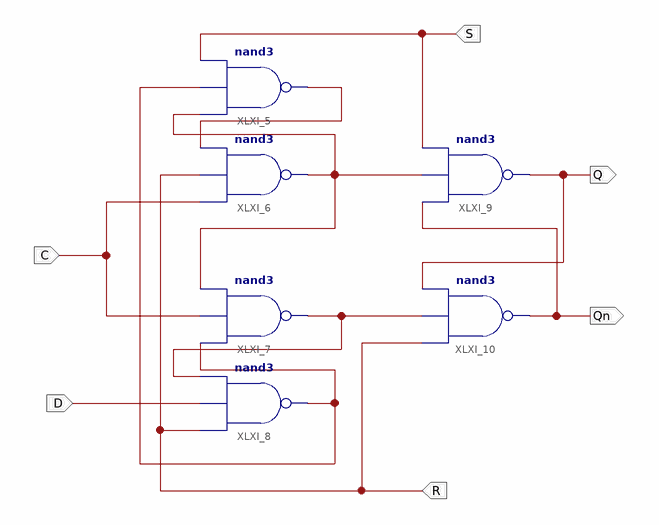
[diagram p0: schematic sheet 1]
// Xilinx ISE schematic D_FLIPFLOP.sch (kintex7) as structural Verilog: 6 symbols, 6 ports
module D_FLIPFLOP (
  input  D,
  input  R,
  input  S,
  input  C,
  output Q,
  output Qn
);

  wire XLXN_1, XLXN_2, XLXN_4, XLXN_14;

  nand XLXI_5 (XLXN_1, XLXN_2, XLXN_14, S);
  nand XLXI_6 (XLXN_2, C, R, XLXN_1);
  nand XLXI_7 (XLXN_4, XLXN_14, C, XLXN_2);
  nand XLXI_8 (XLXN_14, R, D, XLXN_4);
  nand XLXI_9 (Q, Qn, XLXN_2, S);
  nand XLXI_10 (Qn, R, XLXN_4, Q);
endmodule
